# EAGLE schematic PiPowerRF (EAGLE 7.2.0)
CNAME: PiCrusts; CREVISION: 1.0; DESIGNER: Prajwal Bhattaram
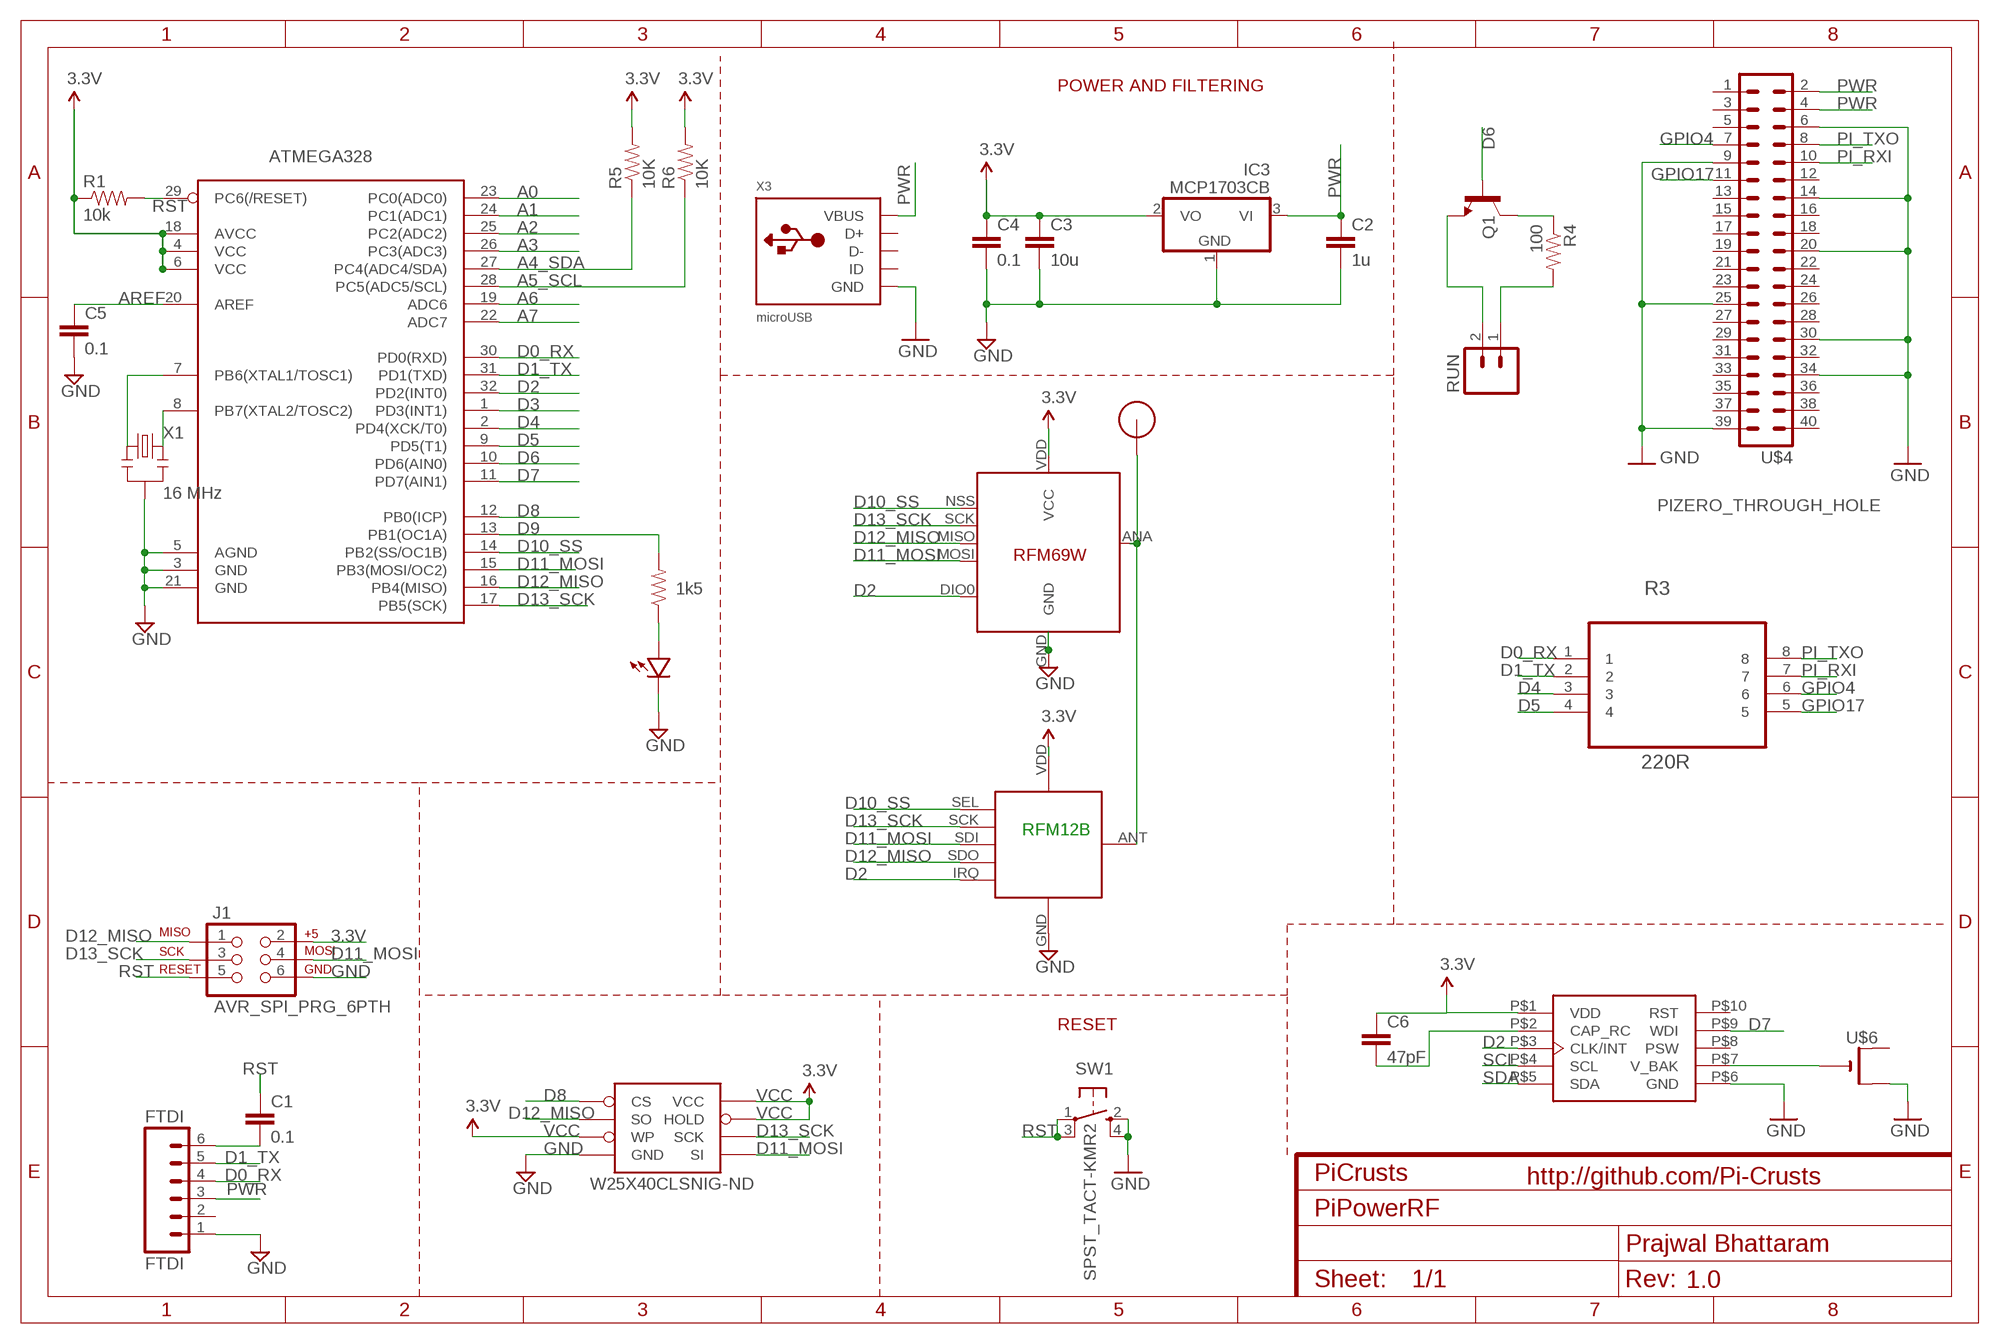
[diagram p0: schematic, sheet 1]

## Parts
ATMEGA328  ATMega-328  ATMEGA168/328TQFP32  [TQFP32-08]
C1  0.1  CAP0603-CAP  [0603-CAP]
C2  1u  CAP0603-CAP  [0603-CAP]
C3  10u  CAP0805-CAP  [0805-CAP]
C4  0.1  CAP0603-CAP  [0603-CAP]
C5  0.1  CAP0603-CAP  [0603-CAP]
C6  47pF  CAP0402-CAP  [0402-CAP]
FTDI  FTDI  M06SIP  [1X06]
IC3  MCP1703CB  [SOT23]
J1  AVR_SPI_PRG_6PTH  [2X3]
Q1  MMBT2222A  TRANSISTOR_NPNMMBT2222A  [SOT23-3]
R1  10k  RESISTOR0603-RES  [0603-RES]
R2  1k5  RESISTOR0603-RES  [0603-RES]
R3  220R  EXB38V221JV  [RESCAXE80P320X160X60-8N]
R4  100  RESISTOR0402-RES  [0402-RES]
R5  10K  RESISTOR0603  [0603-RES]
R6  10K  RESISTOR0603  [0603-RES]
RFM12B  RFM12B_MINPADS  [RFM12B-MINPADS]
RUN  M021X02_NO_SILK  [1X02_NO_SILK]
SW1  SPST_TACT-KMR2  [KMR2]
U$1  RFM12B_ANTENNA  [RFM12B-ANTENNA]
U$2  LED0603  [0603-LED]
U$4  PIZERO_THROUGH_HOLE  [PIZERO_THOUGH_HOLE]
U$5  RFM69  [RFM69W-MINPADS]
U$6  CR1220SMT  [CR1220-SMD]
W25X40CLSNIG-ND  AT25F512BWIDE_5.3MM  [SO08WIDE]
X1  16 MHz  RESONATORSMD  [RESONATOR-SMD]
X2  MC-RTC-RV-1805-C3-I2C  [MC-RTC-C3]
X3  microUSB  USB_MICRO_20329_V2  [4UCONN_20329_V2]

## Nets
3.3V: J1.2
A0: ATMEGA328.23(PC0(ADC0))
A1: ATMEGA328.24(PC1(ADC1))
A2: ATMEGA328.25(PC2(ADC2))
A3: ATMEGA328.26(PC3(ADC3))
A4_SDA: ATMEGA328.27(PC4(ADC4/SDA)) R5.1
A5_SCL: ATMEGA328.28(PC5(ADC5/SCL)) R6.1
A6: ATMEGA328.19(ADC6)
A7: ATMEGA328.22(ADC7)
AREF: ATMEGA328.20(AREF) C5.1
D0_RX: ATMEGA328.30(PD0(RXD)) FTDI.4 R3.1
D1_TX: ATMEGA328.31(PD1(TXD)) FTDI.5 R3.2
D2: ATMEGA328.32(PD2(INT0)) RFM12B.IRQ U$5.DIO0 X2.P$3(CLK/INT)
D3: ATMEGA328.1(PD3(INT1))
D4: ATMEGA328.2(PD4(XCK/T0)) R3.3
D5: ATMEGA328.9(PD5(T1)) R3.4
D6: ATMEGA328.10(PD6(AIN0)) Q1.1(B)
D7: ATMEGA328.11(PD7(AIN1)) X2.P$9(WDI)
D8: ATMEGA328.12(PB0(ICP)) W25X40CLSNIG-ND.1(CS)
D9: ATMEGA328.13(PB1(OC1A)) R2.2
D10_SS: ATMEGA328.14(PB2(SS/OC1B)) RFM12B.SEL U$5.NSS(SEL)
D11_MOSI: ATMEGA328.15(PB3(MOSI/OC2)) J1.4 RFM12B.SDI(SDI/MOSI) U$5.MOSI W25X40CLSNIG-ND.5(SI)
D12_MISO: ATMEGA328.16(PB4(MISO)) J1.1 RFM12B.SDO(SDO/MISO) U$5.MISO W25X40CLSNIG-ND.2(SO)
D13_SCK: ATMEGA328.17(PB5(SCK)) J1.3 RFM12B.SCK U$5.SCK W25X40CLSNIG-ND.6(SCK)
GND [power]: ATMEGA328.3(GND) ATMEGA328.5(AGND) ATMEGA328.21(GND) C2.2 C3.2 C4.2 C5.2 FTDI.1 IC3.1(GND) J1.6 RFM12B.GND SW1.2(S) SW1.4(S1) U$2.MINUS U$4.6 U$4.9 U$4.14 U$4.20 U$4.25 U$4.30 U$4.34 U$4.39 U$5.GND U$6.+$2(+1) W25X40CLSNIG-ND.4(GND) X1.2 X2.P$6(GND) X3.BASE@1(GND) X3.BASE@2(GND) X3.GND X3.SPRT@1(GND) X3.SPRT@2(GND) X3.SPRT@3(GND) X3.SPRT@4(GND)
GPIO4: R3.6 U$4.7
GPIO17: R3.5 U$4.11
N$1: ATMEGA328.7(PB6(XTAL1/TOSC1)) X1.1
N$2: R2.1 U$2.PLUS
N$3: RFM12B.ANT U$1.P$1 U$5.ANA(ANT)
N$4: R4.2 RUN.1
N$5: Q1.2(E) RUN.2
N$6: U$6.- X2.P$7(V_BAK)
N$7: Q1.3(C) R4.1
N$8: C6.2 X2.P$2(CAP_RC)
N$20: C1.2 FTDI.6
N$21: ATMEGA328.8(PB7(XTAL2/TOSC2)) X1.3
PI_RXI: R3.7 U$4.10
PI_TXO: R3.8 U$4.8
PWR [power]: C2.1 FTDI.3 IC3.3(VI) U$4.2 U$4.4 X3.VBUS
RST: ATMEGA328.29(PC6(/RESET)) C1.1 J1.5 R1.2 SW1.1(P) SW1.3(P1)
SCL: X2.P$4(SCL)
SDA: X2.P$5(SDA)
VCC: ATMEGA328.4(VCC) ATMEGA328.6(VCC) ATMEGA328.18(AVCC) C3.1 C4.1 C6.1 IC3.2(VO) R1.1 R5.2 R6.2 RFM12B.VDD U$5.VDD(VCC) W25X40CLSNIG-ND.3(WP) W25X40CLSNIG-ND.7(HOLD) W25X40CLSNIG-ND.8(VCC) X2.P$1(VDD) ; supply symbol labelled 3.3V
Unconnected: FTDI.2 U$4.1 U$4.3 U$4.5 U$4.12 U$4.13 U$4.15 U$4.16 U$4.17 U$4.18 U$4.19 U$4.21 U$4.22 U$4.23 U$4.24 U$4.26 U$4.27 U$4.28 U$4.29 U$4.31 U$4.32 U$4.33 U$4.35 U$4.36 U$4.37 U$4.38 U$4.40 U$6.+$1(+) X2.P$8(PSW) X2.P$10(RST) X3.D+ X3.D- X3.ID

## Notes on the sheet
- POWER AND FILTERING
- RFM12B
- RESET
- http://github.com/Pi-Crusts

## Library data of the parts
ATMEGA328 = LowPowerLab:ATMEGA168/328: Atmel 32-pin 8-bit micro, 16k flash.
C1-C5 = LowPowerLab:CAP: Capacitor Standard 0603 ceramic capacitor, and 0.1" leaded capacitor.
C6 = SparkFun-Capacitors:CAP: Capacitor Standard 0603 ceramic capacitor, and 0.1" leaded capacitor.
FTDI = SparkFun-Connectors:M06: Header 6 Standard 6-pin 0.1" header. Use with straight break away headers (SKU : PRT-00116), right angle break away headers (PRT-00553), swiss pins (PRT-00743), machine pins (PRT-00117), and female headers (PRT-00115). Molex polarized connector foot print use with SKU : PRT-08094 with associated crimp pins and housings. NOTES ON THE VARIANTS LOCK and LOCK_LONGPADS... This footprint was designed to help hold the alignment of a through-hole component (i.e. 6-pin header) while soldering it into place. You may notice that each hole has been shifted either up or down by 0.005 of an inch from it's more standard position (which is a perfectly straight line). This slight alteration caused the pins (the squares in the middle) to touch the edges of the holes. Because they are alternating, it causes a "brace" to hold the component in place. 0.005 has proven to be the perfect amount of "off-center" position when using our standard breakaway headers. Although looks a little odd when you look at the bare footprint, once you have a header in there, the alteration is very hard to notice. Also, if you push a header all the way into place, it is covered up entirely on the bottom side. This idea of altering the position of holes to aid alignment will be further integrated into the Sparkfun Library for other footprints. It can help hold any component with 3 or more connection pins.
IC3 = linear:MCP1703: 250 mA, 16V, Low Quiescent Current LDO Regulator Source: http://ww1.microchip.com/downloads/en/DeviceDoc/22049b.pdf
J1 = SparkFun-Connectors:AVR_SPI_PRG_6: AVR ISP 6 Pin This is the reduced ISP connector for AVR programming. Common on Arduino. This footprint will take up less PCB space and can be used with a 10-pin to 6-pin adapter such as SKU: BOB-08508
Q1 = SparkFun-DiscreteSemi:TRANSISTOR_NPN: Generic NPN BJT MMBT2222A - TRANS-08049 (SOT-23, 1A 40V) MPSA42 - TRANS-09116 (SOT-23, 500mA 300V) MMBT5088LT1G - TRANS-11160 (SOT-23, 50 mA 30V); PROD_ID: TRANS-08049
R1 R2 = LowPowerLab:RESISTOR: Resistor Basic schematic elements and footprints for 0603, 1206, and PTH resistors.
R3 = Panasonic-EXB-ERJ:EXB38V: Chip Resistor Array; MPN: EXB38V221JV; OC_FARNELL: 2060094; OC_NEWARK: 65T9093; PACKAGE: 0603; POWERRATING: 0.063 W/element; SUPPLIER: PANASONIC; TOLERANCE: ±5 %
R4 = SparkFun-Passives:RESISTOR: Resistor Basic schematic elements and footprints for 0603, 1206, and PTH resistors.
R5 R6 = SparkFun-Resistors:RESISTOR: Resistor Basic schematic elements and footprints for 0603, 1206, and PTH resistors.
RFM12B = LowPowerLab:RFM12B_MINPADS
RUN = SparkFun-Connectors:M02: Standard 2-pin 0.1" header. Use with - straight break away headers ( PRT-00116) - right angle break away headers (PRT-00553) - swiss pins (PRT-00743) - machine pins (PRT-00117) - female headers (PRT-00115) Molex polarized connector foot print use with: PRT-08233 with associated crimp pins and housings. 2.54_SCREWTERM for use with PRT-10571. 3.5mm Screw Terminal footprints for PRT-08084 5mm Screw Terminal footprints for use with PRT-08433
SW1 = adafruit:SPST_TACT: SMT 6mm switch, EVQQ2 series http://www.ladyada.net/library/eagle
U$1 = LowPowerLab:RFM12B_ANTENNA
U$2 = LowPowerLab:LED
U$4 = pizero:PIZERO_THROUGH_HOLE
U$5 = LowPowerLab:RFM69
U$6 = adafruit:CR1220: CR1216/CR1220/CR1225 12mm 3V lithium coin cell Great for battery packup. Both SMT and THM holders. Note the THM package has the ground pads on both sides of the PCB so that the masks are the same - this reduces the cost
W25X40CLSNIG-ND = LowPowerLab:AT25F512B: 4-Mbit SPI flash memory
X1 = SparkFun:RESONATOR: Resonator Small SMD resonator. This is the itty bitty 10/20MHz resonators with built in caps. CSTCE10M0G55 and CSTCE20M0V53. Footprint has been reviewed closely but hasn't been tested yet.
X2 = Microcrystal-RTC:MC-RTC-RV-1805-C3-I2C: MicroCrystal RV-1805-C3 Extreme Low Power RTC Module Extreme Low Current consumption XTAL-Mode 60nA RC-Mode 17nA RC Autocalibrated Mode 22nA Factory calibrated Time accuracy typ. ±2.0ppm @ 25°C Miniature SMT ceramic package with integrated Quartz Crystal for best Noise & EMI Immunity Automatic Battery Switchover, Trickle Charger, Power Management & Power Switch Function Programmable CLKOUT frequencies I2C Bus Interface (fast mode 400kHz) Time keeping mode down to 1.5 V Programmable Alarm, Timer and INT 512 Bytes of User RAM
X3 = microbuilder:USB: USB Connectors USBMINIB - Surface Mount Female Mini-B USB Connector 4UConnector: 06564

## Net classes
1 power: width 0.381 mm, clearance 0.254 mm